# Altium project LED_Driver_48.PrjPcb
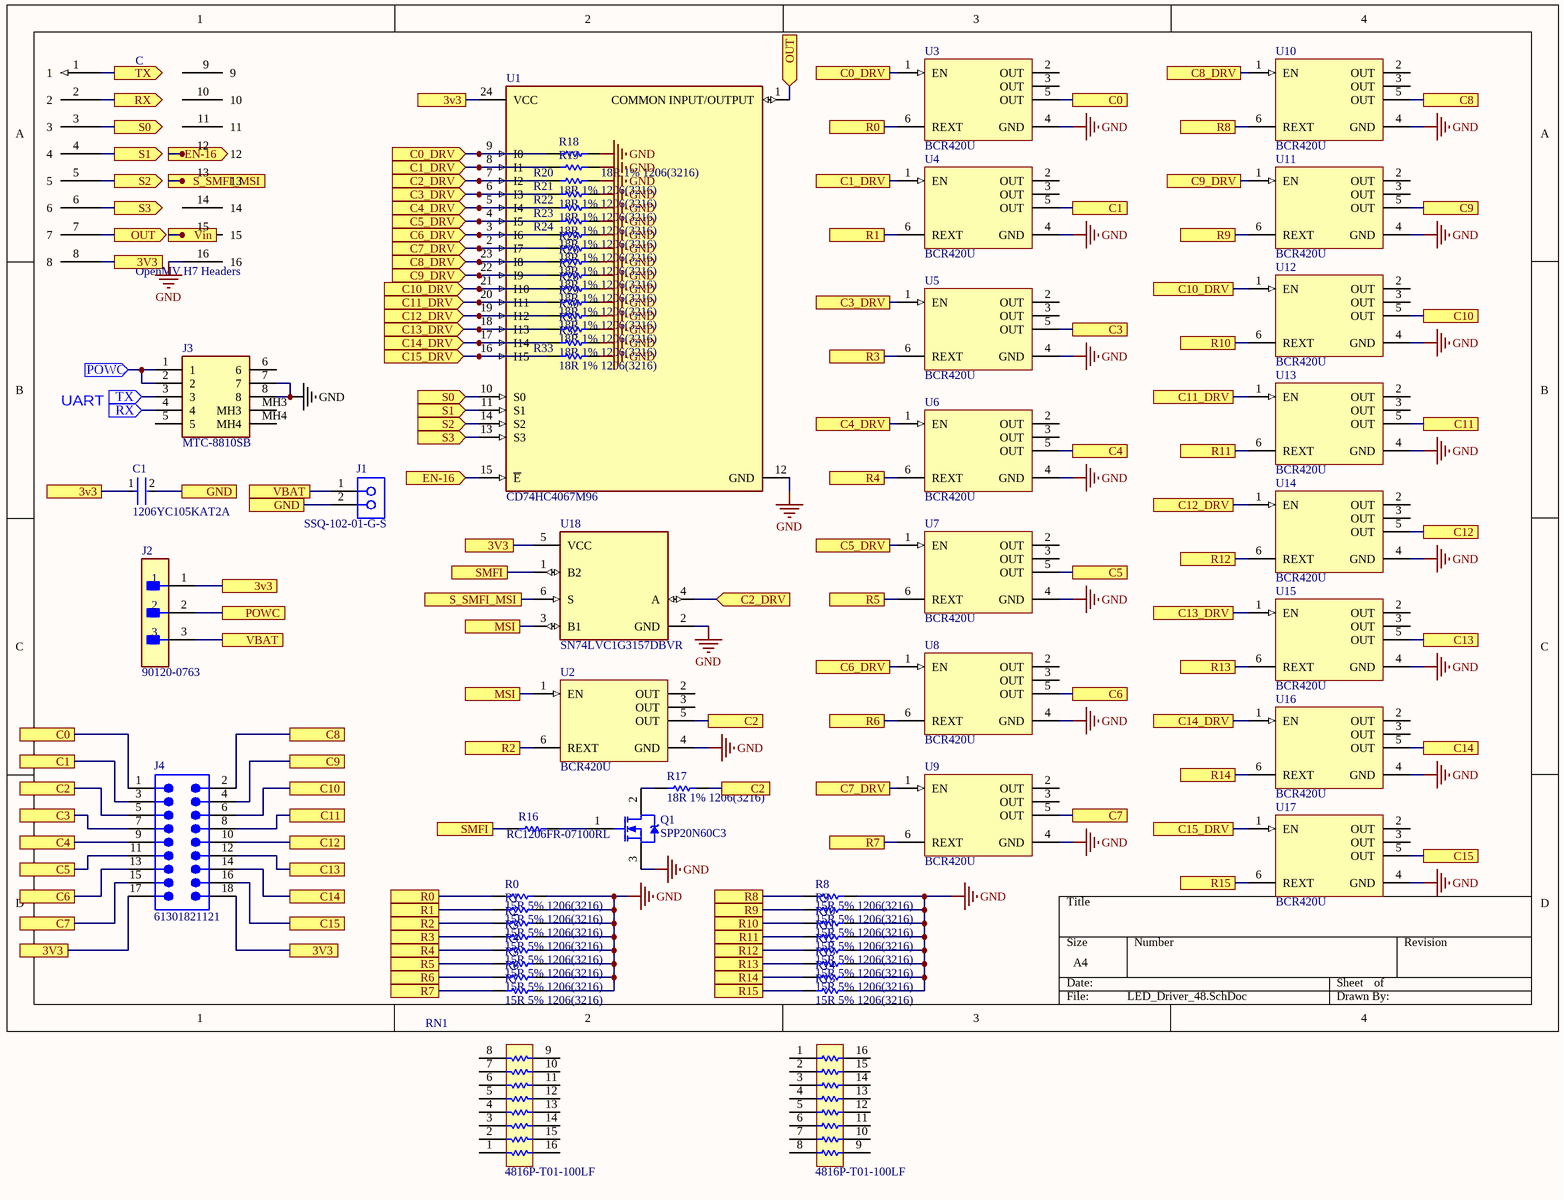
[diagram p0: LED_Driver_48.SchDoc]
1 sheet, 61 parts. Net scope: flat (ports and power ports of the same name join across sheets).
Board file: LED_Driver_48.PcbDoc

## Sheet LED_Driver_48.SchDoc
size A4; SheetNumber: 1; SheetTotal: 1

### Parts
C  OpenMV H7 Headers  [OpenMV H7]
C1  1206YC105KAT2A  [FP-1206-L_3_2_0_2-W_1_6_0-IPC_A]
J1  SSQ-102-01-G-S  [SMTC-SSQ-102-01-X-S]
J2  90120-0763  [FP-90120-0763-MFG]
J3  MTC-8810SB  [MTC8810SB]
J4  61301821121  [61301821121]
Q1  SPP20N60C3  [INF-PG-TO220-3-1]
R0  15R 5% 1206(3216)  [RESC1206(3216)_M]
R1  15R 5% 1206(3216)  [RESC1206(3216)_M]
R2  15R 5% 1206(3216)  [RESC1206(3216)_M]
R3  15R 5% 1206(3216)  [RESC1206(3216)_M]
R4  15R 5% 1206(3216)  [RESC1206(3216)_M]
R5  15R 5% 1206(3216)  [RESC1206(3216)_M]
R6  15R 5% 1206(3216)  [RESC1206(3216)_M]
R7  15R 5% 1206(3216)  [RESC1206(3216)_M]
R8  15R 5% 1206(3216)  [RESC1206(3216)_M]
R9  15R 5% 1206(3216)  [RESC1206(3216)_M]
R10  15R 5% 1206(3216)  [RESC1206(3216)_M]
R11  15R 5% 1206(3216)  [RESC1206(3216)_M]
R12  15R 5% 1206(3216)  [RESC1206(3216)_M]
R13  15R 5% 1206(3216)  [RESC1206(3216)_M]
R14  15R 5% 1206(3216)  [RESC1206(3216)_M]
R15  15R 5% 1206(3216)  [RESC1206(3216)_M]
R16  RC1206FR-07100RL  [RESC3116X65X40ML10T20]
R17  18R 1% 1206(3216)  [RESC1206(3216)_M]
R18  18R 1% 1206(3216)  [RESC1206(3216)_M]  (value not drawn)
R19  18R 1% 1206(3216)  [RESC1206(3216)_M]
R20  18R 1% 1206(3216)  [RESC1206(3216)_M]
R21  18R 1% 1206(3216)  [RESC1206(3216)_M]
R22  18R 1% 1206(3216)  [RESC1206(3216)_M]
R23  18R 1% 1206(3216)  [RESC1206(3216)_M]
R24  18R 1% 1206(3216)  [RESC1206(3216)_M]
R25  18R 1% 1206(3216)  [RESC1206(3216)_M]
R26  18R 1% 1206(3216)  [RESC1206(3216)_M]
R27  18R 1% 1206(3216)  [RESC1206(3216)_M]
R28  18R 1% 1206(3216)  [RESC1206(3216)_M]
R29  18R 1% 1206(3216)  [RESC1206(3216)_M]
R30  18R 1% 1206(3216)  [RESC1206(3216)_M]
R31  18R 1% 1206(3216)  [RESC1206(3216)_M]
R32  18R 1% 1206(3216)  [RESC1206(3216)_M]
R33  18R 1% 1206(3216)  [RESC1206(3216)_M]
RN1  4816P-T01-100LF  [BOUR-SOM-16_V]
RN2  4816P-T01-100LF  [BOUR-SOM-16_V]
U1  CD74HC4067M96  [FP-DW0024A-MFG]
U2  BCR420U  [INF-SC74_N]
U3  BCR420U  [INF-SC74_N]
U4  BCR420U  [INF-SC74_N]
U5  BCR420U  [INF-SC74_N]
U6  BCR420U  [INF-SC74_N]
U7  BCR420U  [INF-SC74_N]
U8  BCR420U  [INF-SC74_N]
U9  BCR420U  [INF-SC74_N]
U10  BCR420U  [INF-SC74_N]
U11  BCR420U  [INF-SC74_N]
U12  BCR420U  [INF-SC74_N]
U13  BCR420U  [INF-SC74_N]
U14  BCR420U  [INF-SC74_N]
U15  BCR420U  [INF-SC74_N]
U16  BCR420U  [INF-SC74_N]
U17  BCR420U  [INF-SC74_N]
U18  SN74LVC1G3157DBVR  [FP-DBV0006A-IPC_A]

### Ports
3V3, 3v3, C0, C0_DRV, C0_DRV (in), C1, C1_DRV, C1_DRV (in), C2, C2_DRV (in), C3, C3_DRV, C3_DRV (in), C4, C4_DRV, C4_DRV (in), C5, C5_DRV, C5_DRV (in), C6, C6_DRV, C6_DRV (in), C7, C7_DRV, C7_DRV (in), C8, C8_DRV, C8_DRV (in), C9, C9_DRV, C9_DRV (in), C10, C10_DRV, C10_DRV (in), C11, C11_DRV, C11_DRV (in), C12, C12_DRV, C12_DRV (in), C13, C13_DRV, C13_DRV (in), C14, C14_DRV, C14_DRV (in), C15, C15_DRV, C15_DRV (in), EN-16 (in), EN-16 (out), GND, MSI, OUT (in), OUT (out), POWC, POWC (in), R0, R1, R2, R3, R4, R5, R6, R7, R8, R9, R10, R11, R12, R13, R14, R15, RX (in), RX (out), S0 (in), S0 (out), S1 (in), S1 (out), S2 (in), S2 (out), S3 (in), S3 (out), S_SMFI_MSI, SMFI, TX (in), TX (out), VBAT, Vin

### Nets
GND: C.16 J3.7 J3.8 Q1.3(SOURCE) R0.2 R1.2 R2.2 R3.2 R4.2 R5.2 R6.2 R7.2 R8.2 R9.2 R10.2 R11.2 R12.2 R13.2 R14.2 R15.2 R18.1 R19.1 R20.1 R21.1 R22.1 R23.1 R24.1 R25.1 R26.1 R27.1 R28.1 R29.1 R30.1 R31.1 R32.1 R33.1 U1.12(GND) U2.4(GND) U3.4(GND) U4.4(GND) U5.4(GND) U6.4(GND) U7.4(GND) U8.4(GND) U9.4(GND) U10.4(GND) U11.4(GND) U12.4(GND) U13.4(GND) U14.4(GND) U15.4(GND) U16.4(GND) U17.4(GND) U18.2(GND)
NetC1_2: C1.2 J1.2 ; port GND
NetC_1: C.1 J3.3 ; port TX
NetC_2: C.2 J3.4 ; port RX
NetC_3: C.3 U1.10(S0) ; port S0
NetC_4: C.4 U1.11(S1) ; port S1
NetC_5: C.5 U1.14(S2) ; port S2
NetC_6: C.6 U1.13(S3) ; port S3
NetC_7: C.7 U1.1(COMMON_INPUT/OUTPUT) ; port OUT
NetC_8: C.8 C1.1 J2.1 J4.17 J4.18 U1.24(VCC) U18.5(VCC) ; port 3V3, port 3v3
NetC_12: C.12 U1.15(~{E}) ; port EN-16
NetC_13: C.13 U18.6(S) ; port S_SMFI_MSI
NetC_15: C.15 ; port Vin
NetJ1_1: J1.1 J2.3 ; port VBAT
NetJ2_2: J2.2 J3.1 J3.2 ; port POWC
NetJ4_1: J4.1 U3.5(OUT) ; port C0
NetJ4_2: J4.2 U10.5(OUT) ; port C8
NetJ4_3: J4.3 U4.5(OUT) ; port C1
NetJ4_4: J4.4 U11.5(OUT) ; port C9
NetJ4_5: J4.5 R17.1 U2.5(OUT) ; port C2
NetJ4_6: J4.6 U12.5(OUT) ; port C10
NetJ4_7: J4.7 U5.5(OUT) ; port C3
NetJ4_8: J4.8 U13.5(OUT) ; port C11
NetJ4_9: J4.9 U6.5(OUT) ; port C4
NetJ4_10: J4.10 U14.5(OUT) ; port C12
NetJ4_11: J4.11 U7.5(OUT) ; port C5
NetJ4_12: J4.12 U15.5(OUT) ; port C13
NetJ4_13: J4.13 U8.5(OUT) ; port C6
NetJ4_14: J4.14 U16.5(OUT) ; port C14
NetJ4_15: J4.15 U9.5(OUT) ; port C7
NetJ4_16: J4.16 U17.5(OUT) ; port C15
NetQ1_1: Q1.1(GATE) R16.2
NetQ1_2: Q1.2(DRAIN) R17.2
NetR0_1: R0.1 U3.6(REXT) ; port R0
NetR1_1: R1.1 U4.6(REXT) ; port R1
NetR2_1: R2.1 U2.6(REXT) ; port R2
NetR3_1: R3.1 U5.6(REXT) ; port R3
NetR4_1: R4.1 U6.6(REXT) ; port R4
NetR5_1: R5.1 U7.6(REXT) ; port R5
NetR6_1: R6.1 U8.6(REXT) ; port R6
NetR7_1: R7.1 U9.6(REXT) ; port R7
NetR8_1: R8.1 U10.6(REXT) ; port R8
NetR9_1: R9.1 U11.6(REXT) ; port R9
NetR10_1: R10.1 U12.6(REXT) ; port R10
NetR11_1: R11.1 U13.6(REXT) ; port R11
NetR12_1: R12.1 U14.6(REXT) ; port R12
NetR13_1: R13.1 U15.6(REXT) ; port R13
NetR14_1: R14.1 U16.6(REXT) ; port R14
NetR15_1: R15.1 U17.6(REXT) ; port R15
NetR16_1: R16.1 U18.1(B2) ; port SMFI
NetR18_2: R18.2 U1.9(I0) U3.1(EN) ; port C0_DRV
NetR19_2: R19.2 U1.8(I1) U4.1(EN) ; port C1_DRV
NetR20_2: R20.2 U1.7(I2) U18.4(A) ; port C2_DRV
NetR21_2: R21.2 U1.6(I3) U5.1(EN) ; port C3_DRV
NetR22_2: R22.2 U1.5(I4) U6.1(EN) ; port C4_DRV
NetR23_2: R23.2 U1.4(I5) U7.1(EN) ; port C5_DRV
NetR24_2: R24.2 U1.3(I6) U8.1(EN) ; port C6_DRV
NetR25_2: R25.2 U1.2(I7) U9.1(EN) ; port C7_DRV
NetR26_2: R26.2 U1.23(I8) U10.1(EN) ; port C8_DRV
NetR27_2: R27.2 U1.22(I9) U11.1(EN) ; port C9_DRV
NetR28_2: R28.2 U1.21(I10) U12.1(EN) ; port C10_DRV
NetR29_2: R29.2 U1.20(I11) U13.1(EN) ; port C11_DRV
NetR30_2: R30.2 U1.19(I12) U14.1(EN) ; port C12_DRV
NetR31_2: R31.2 U1.18(I13) U15.1(EN) ; port C13_DRV
NetR32_2: R32.2 U1.17(I14) U16.1(EN) ; port C14_DRV
NetR33_2: R33.2 U1.16(I15) U17.1(EN) ; port C15_DRV
NetU2_1: U2.1(EN) U18.3(B1) ; port MSI

Not connected (* = marked no-connect by the designer): C 9 10 11 14; J3 5 6 MH3 MH4; RN1 1 2 3 4 5 6 7 8 9 10 11 12 13 14 15 16; RN2 1 2 3 4 5 6 7 8 9 10 11 12 13 14 15 16; U2 2(OUT) 3(OUT); U3 2(OUT) 3(OUT); U4 2(OUT) 3(OUT); U5 2(OUT) 3(OUT); U6 2(OUT) 3(OUT); U7 2(OUT) 3(OUT); U8 2(OUT) 3(OUT); U9 2(OUT) 3(OUT); U10 2(OUT) 3(OUT); U11 2(OUT) 3(OUT); U12 2(OUT) 3(OUT); U13 2(OUT) 3(OUT); U14 2(OUT) 3(OUT); U15 2(OUT) 3(OUT); U16 2(OUT) 3(OUT); U17 2(OUT) 3(OUT)

### Notes on the sheet
- UART

### Library data of the parts
C1 = CMP-04427-000085-1: General Purpose Ceramic Capacitor, 1206, 1uF, 10%, X7R, 15%, 16V; Insulation Resistance: 100GR; Dissipation Factor: 3.5%; Termination: SMD/SMT; Voltage: 16V; RoHS Compliant: Yes; Lead Free: Lead Free; Voltage Rating: 16V; Construction: Flat; Case/Package: 1206; Packaging: Tape and Reel; Tolerance: 10%; Case Code (Imperial): 1206; Max Operating Temperature: 125°C; REACH SVHC: No SVHC; Length: 3.2mm; Number of Pins: 2; Case Code (Metric): 3216; Dielectric: X7R; Depth: 1.6mm; Radiation Hardening: No; Series: 1206; Weight: 0.000571oz; Height: 1.27mm; Min Operating Temperature: -55°C; Mount: Surface Mount; Width: 1.6mm; Package Quantity: 3000; Thickness: 0.05inch; Dielectric Material: Ceramic; Voltage Rating (DC): 16V; Capacitance: 1uF
J1 = CMP-1023-00275-1: SQ Post Socket, Through-hole, Vertical, -55 to 125 degC, 2.54 mm Pitch, 2-Pin, Female, RoHS; Manufacturer: Samtec; Pitch: 2.54 mm; ComponentLink1URL: http://www.samtec.com; ComponentLink3URL: http://www.samtec.com/documents/webfiles/cpdf/SSQ-1XX-XX-XXX-X-XX-XXX-XX-X-MKT.pdf; Temperature Range: -55 to 125 degC; PackageDescription: Assembly, Socket Strip .025[0.64] SQ Tail; RoHS: True; PackageVersion: BD, 6/1987; ComponentLink3Description: Package Specification; PackageReference: SSQ-102-01-X-S; ComponentLink2Description: Datasheet; ComponentLink2URL: http://www.samtec.com/documents/webfiles/pdf/SSQ_TH.PDF; ComponentLink1Description: Manufacturer URL; DatasheetVersion: F-214; Orientation: Vertical; Mounting Technology: Through-hole; PartNumber: SSQ-102-01-G-S
J2 = CMP-04776-000084-1: CONN HEADER VERT 3POS 2.54MM; Manufacturer: Molex; Voltage Rating: 350V; Number Of Contacts: 3; Conn Orientation: Vertical; Current Rating: 3A; Conn Gender: Male; Package: 90120-0763; ComponentLink2Description: Datasheet; Height: 5.8mm; Manufacturer Part Number: 90120-0763; Temperature Range High: +125°C; RoHS: TRUE; ComponentLink2URL: https://www.molex.com/webdocs/datasheets/pdf/en-us/0901200763_PCB_HEADERS.pdf; Device Class L2: Headers and Wire Housings; Temperature: -55°C to +125°C; Device Class L1: Connectors; Pitch: 2.54mm; Footprint Url: https://www.molex.com/pdm_docs/sd/901200763_sd.pdf; Device Class L3: unset; Temperature Range Low: -55°C; Number Of Rows: 1; Category: Conn; Lead Free: Yes; Mouser Description: Board-To-Board Connector, C-Grid III 90120 Series, Through Hole, Header, 3, 2.54 mm; Octopart: https://octopart.com/90120-0763-molex-655433; Contact Material: Gold,Nickel; Automotive: No; Digikey Description: CONN HEADER VERT 3POS 2.54MM
J3 = MTC-8810SB: Connector; Manufacturer_Name: RS Components; Height: 13.45mm; RS Part Number: 3316443; RS Price/Stock: https://uk.rs-online.com/web/p/products/3316443; Manufacturer_Part_Number: MTC-8810SB
J4 = CMP-1502-01101-2: NexarPartId: 32855553; Operating Supply Voltage: 250V; Pitch: 2.54mm; Contact Resistance: 20mΩ; Number of Contacts: 18; Current Rating: 3A; Gender: Male; Connector Type: Male Pin; Number of Pins: 18; Number of Rows: 2; Row Spacing: 2.54mm; REACH SVHC: Unknown; Mount: Through Hole; Contact Mating Length: 5.9944mm; Contact Material: Copper; Color: Black; Orientation: Vertical; RoHS: Compliant; Contact Plating: Gold; Number of Positions: 18; Packaging: Bulk; Lead Pitch: 2.54mm; Termination: Solder
Q1 = CMP-1164-00011-1: N-Channel CoolMOS Power-Transistor, 600 V VDS, 20.7 A ID, -55 to 150 degC, PG-TO220-3-1, Tube, Green; Manufacturer: Infineon; RDS (on) (max): 190Â mOhm; VDS (max): 600Â V; IDpuls (max): 62.1Â A; RthJA (max): 62Â K/W; Ptot (max): 208Â W; Polarity: N; VGS(th) (max): 3.9Â V; ID (max): 20.7Â A; Green: TRUE; VGS(th) (min): 2.1Â V; QG: 87Â nC; RthJC (max): 0.6Â K/W; DatasheetVersion: Rev. 3.2; ComponentLink1Description: Manufacturer URL; Mounting Technology: Through Hole; PackageReference: PG-TO220-3-1; PackageDescription: 3-Pin Plastic (Green) Transistor Single Outline Package, 10 x 9.25 mm Body, 2.54 mm Pitch; Packing: Tube; ComponentLink2URL: http://www.infineon.com/dgdl/SPP_I_A20N60C3_Rev3.2.pdf?folderId=db3a304412b407950112b408e8c90004&fileId=db3a304412b407950112b42d841f488f; ComponentLink3URL: http://www.infineon.com/dgdl/BTS117_DS_14.pdf?folderId=db3a30431400ef68011421b54e2e0564&fileId=db3a30433a747525013abff8302d549c&location=en.Products.Automotive_ICs.Smart_High-_and_Low-Side_Switches.HITFET___TEMPFET__-_Smart_Low-Side_Switches.DATASHEET.BTS1; Technology: CoolMOS C3; PartNumber: SPP20N60C3; PackageVersion: Jul-12; ComponentLink1URL: http://www.infineon.com/; ComponentLink3Description: Package Specification; ComponentLink2Description: Datasheet; Rth: 0.6Â K/W
R0-R15 = CMP-1014-00030-1: 15R 0.25W 5% 1206 (3216 Metric)  SMD; Case-Metric: 3216; Value: 15.00 Ohm; Case-EIA: 1206; Technology: SMT; Tolerance: 5 %; Power: 0.25 W
R16 = CMP-2100-03675-1: Chip Resistor, 100 Ohm, +/- 1%, 0.25 W, -55 to 155 degC, 1206 (3216 Metric), RoHS, Tape and Reel; Manufacturer: Yageo; Voltage Rating: 200V; Power Rating: 250mW; Resistance: 100Ohm; Temperature Coefficient: 100ppm/degreesC; Case Code (Imperial): 1206; Datasheet Version: Rev. 5, 10/2016; Case Code (Metric): 3216; Packaging: TapeandReel; Composition: ThickFilm; Height: 0.55mm; Lead Free: LeadFree; Depth: 1.6mm; Package Reference: 1206.0; Termination: SMD/SMT; Case/Package: 1206; Package Quantity: 5000; Datasheet URL: http://www.yageo.com/NewPortal/yageodocoutput?fileName=/pdf/R-Chip/PYu-RC_Group_51_RoHS_L_5.pdf; REACH SVHC: Unknown; Max Operating Temperature: 155degC; Length: 3.1mm; Manufacturer URL: http://www.yageo.com/; Min Operating Temperature: -55degC; Tolerance: 1%; RoHSCompliant: true; Width: 1.6mm; Package Description: 2-Pin Surface Mount Device, Body 3.1 x 1.6 mm
R17-R33 = CMP-1014-00311-1: 18R 0.25W 1% 1206 (3216 Metric)  SMD; Value: 18.00 Ohm; Case-EIA: 1206; Case-Metric: 3216; Tolerance: 1 %; Power: 0.25 W; Technology: SMT
RN1 RN2 = CMP-2000-05612-1: 4800P Series Isolated Resistor, 10 Ohm, +/- 2%, -55 to 125 degC, 16-Pin SMD, RoHS, Tube; Manufacturer: Bourns; Temperature Coefficient: ±250ppm/°C; Resistance (Ohms): 10; Power Per Element: 160mW; Other Names: 4816PT01100LF; PCN Design/Specification: 41xx,43xx,44x,48xxModelMay2012; Power Rating: 1.28W; Number of Resistors: 8; Tolerance: ±1Ohm; Size / Dimension: 0.440"Lx0.220"W(11.18mmx5.59mm); Mounting Technology: SurfaceMount; Package Reference: SOM-16; Number of Pins: 16; Applications: AutomotiveAEC-Q200; Manufacturer URL: http://www.bourns.com/; Family: ResistorNetworks,Arrays; Packaging: Tube; Package / Case: 16-SOIC(0.220",5.59mmWidth); Height: 0.085"(2.16mm); Category: Resistors; Standard Package: 50; Operating Temperature: -55°C~125°C; Series: 4800P; Circuit Type: Isolated; Datasheet Version: Rev. 04/15, 04/2015; Mounting Type: SurfaceMount; Package Description: 16-Pin Small Outline Integrated Circuit, Body 11.18 x 5.59 mm, Pitch 1.27 mm; Datasheet URL: http://www.bourns.com/docs/Product-Datasheets/4800P.pdf; Online Catalog: 4800PSeries; Supplier Device Package: 16-SOM
U1 = CMP-04901-000007-1: IC MUX/DEMUX 1X16 24SOIC; Manufacturer: Texas Instruments; Standoff Height: 0.1mm; Logic Function Desc: Non-Inverting; Max Supply Voltage: 6V; Number Of Inputs: 16; Quiescent Current: 8uA; Number Of Circuits: 1; Propagation Delay: 6ns; Max Junction Temp: +150°C; Min Supply Voltage: 2V; ComponentLink2Description: Datasheet; Octopart: https://octopart.com/cd74hc4067m96-texas+instruments-722802; Ambient Temperature Range High: +125°C; Ipc Land Pattern Name: SOIC127P1030X265-24; Height: 2.65mm; Mouser Description: Multiplexer Switch ICs Hi-Spd CMOS 16Ch Anl Mltplxr/Demltplxr; Temperature Range Low: -55°C; Package: DW0024A; Temperature Range High: +125°C; Lead Free: Yes; ComponentLink2URL: http://www.ti.com/lit/ds/symlink/cd74hc4067.pdf; Manufacturer Part Number: CD74HC4067M96; RoHS: TRUE; Automotive: No; Device Class L1: Integrated Circuits (ICs); Digikey Description: IC MUX/DEMUX 1X16 24SOIC; Device Class L2: Logic ICs; Temperature: -55°C to +125°C; Device Class L3: Multiplexers; Category: IC; Ambient Temperature Range Low: -55°C; Number Of Outputs: 1
U2-U17 = CMP-1139-00012-1: LED Driver, 1.4 to 40 V, SC74, Reel, Pb-free; Manufacturer: Infineon; VS (max): 40 V; VS (min): 1.4 V; Green: TRUE; DatasheetVersion: Revision 2.0; ComponentLink2URL: http://www.infineon.com/dgdl/Infineon-BCR420U-BCR421U-LED-Driver-Rev2.0.pdf?folderId=db3a30431f848401011fcbf2ab4c04c4&fileId=db3a304324fc7f9a01252046582f4302&location=en.Products.LED_Drivers___Lighting_ICs.LED_Driver_for_Outdoor_Lighting___Indoor_Lighting.; Mounting Technology: Surface Mount; ComponentLink1URL: http://www.infineon.com/; ComponentLink3URL: http://www.infineon.com/dgdl/SC74-Package_Overview.pdf?folderId=db3a30431936bc4b01194dec844f40d9&fileId=db3a30431936bc4b01195175d46e3ab3; PackageReference: SC74; ComponentLink1Description: Manufacturer URL; PartNumber: BCR420U; PackageDescription: 6-Pin Semiconductor Package, 2.9 x 1.6 mm Body, 0.95 mm Pitch; ComponentLink2Description: Datasheet; PackageVersion: Apr-08; Type: Linear; Packing: Reel; ComponentLink3Description: Package Specification
U18 = CMP-0859-00203-4: IC SWITCH SPDT SOT23-6; Number of Outputs: 2; Propagation Delay: 300ps; On-State Resistance: 15R; Nominal Supply Current: 10uA; Number of Inputs: 1; Max Supply Voltage: 5.5V; Supply Type: Single; Low Level Output Current: 128mA; Bandwidth: 300MHz; Turn-Off Delay Time: 3.8ns; Turn-On Delay Time: 5.7ns; Operating Supply Current: 1uA; Min Supply Voltage: 1.65V; Polarity: Non-Inverting; Height: 1.3mm; Number of Bits: 1; Case/Package: SOT-23; REACH SVHC: No SVHC; High Level Output Current: 128mA; Weight: 0.000229oz; Max Supply Current: 10uA; Width: 1.75mm; Radiation Hardening: No; Supply Current: 10uA; Length: 3.05mm; Max Operating Temperature: 125°C; Min Operating Temperature: -40°C; Package Quantity: 3000; Number of Pins: 6; Termination: SMD/SMT; Series: 74LVC; Packaging: Tape and Reel; Lead Free: Lead Free; Contact Plating: Gold; Mount: Surface Mount; RoHS Compliant: Yes; Number of Channels: 1; Throw Configuration: SPDT